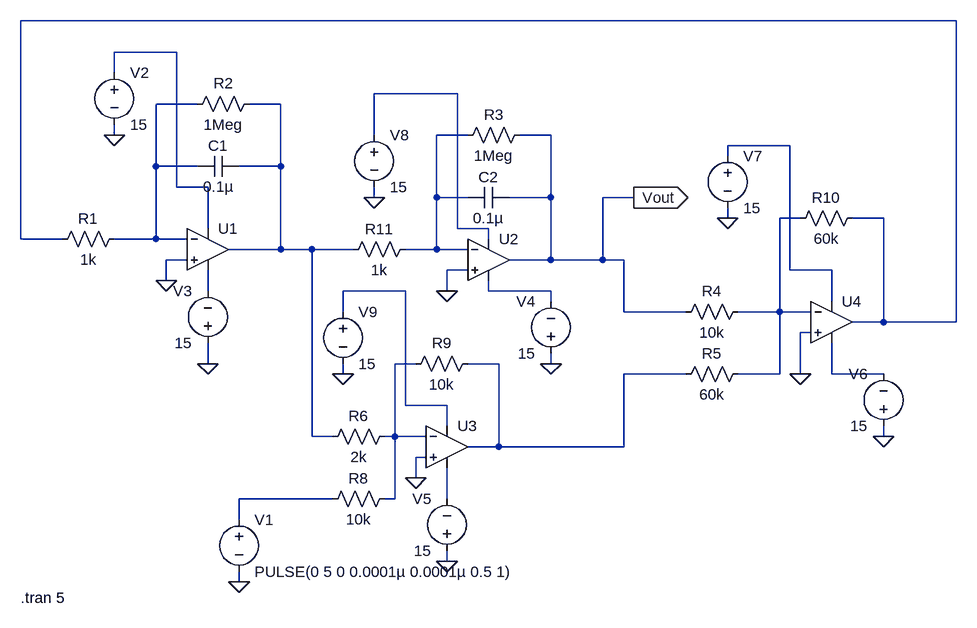
[diagram p0: schematic differential_equation_solver.asc]
differential_equation_solver.asc, the LTspice schematic file:
Version 4
SHEET 1 1252 680
WIRE 1248 -288 -192 -288
WIRE 48 -240 -48 -240
WIRE -48 -208 -48 -240
WIRE 480 -176 352 -176
WIRE 80 -160 16 -160
WIRE 208 -160 160 -160
WIRE -48 -112 -48 -128
WIRE 352 -112 352 -176
WIRE 496 -112 448 -112
WIRE 624 -112 576 -112
WIRE 992 -96 896 -96
WIRE 896 -80 896 -96
WIRE 16 -64 16 -160
WIRE 80 -64 16 -64
WIRE 208 -64 208 -160
WIRE 208 -64 144 -64
WIRE 48 -32 48 -240
WIRE 96 -32 48 -32
WIRE 352 -16 352 -32
WIRE 448 -16 448 -112
WIRE 496 -16 448 -16
WIRE 624 -16 624 -112
WIRE 624 -16 560 -16
WIRE 752 -16 704 -16
WIRE 896 16 896 0
WIRE 1008 16 976 16
WIRE 1136 16 1088 16
WIRE 96 32 96 -32
WIRE 480 32 480 -176
WIRE 528 32 480 32
WIRE -192 48 -192 -288
WIRE -128 48 -192 48
WIRE 16 48 16 -64
WIRE 16 48 -48 48
WIRE 64 48 16 48
WIRE 528 48 528 32
WIRE 208 64 208 -64
WIRE 208 64 128 64
WIRE 256 64 208 64
WIRE 320 64 256 64
WIRE 448 64 448 -16
WIRE 448 64 400 64
WIRE 496 64 448 64
WIRE 64 80 32 80
WIRE 624 80 624 -16
WIRE 624 80 560 80
WIRE 704 80 704 -16
WIRE 704 80 624 80
WIRE 736 80 704 80
WIRE 496 96 464 96
WIRE 992 96 992 -96
WIRE 1056 96 992 96
WIRE 32 112 32 80
WIRE 96 128 96 96
WIRE 400 128 304 128
WIRE 464 128 464 96
WIRE 528 128 528 112
WIRE 624 128 528 128
WIRE 624 144 624 128
WIRE 1056 144 1056 96
WIRE 304 160 304 128
WIRE 736 160 736 80
WIRE 832 160 736 160
WIRE 976 160 976 16
WIRE 976 160 912 160
WIRE 1024 160 976 160
WIRE 1136 176 1136 16
WIRE 1136 176 1088 176
WIRE 1248 176 1248 -288
WIRE 1248 176 1136 176
WIRE 1024 192 1008 192
WIRE 96 240 96 208
WIRE 416 240 384 240
WIRE 544 240 496 240
WIRE 624 240 624 224
WIRE 304 256 304 240
WIRE 832 256 736 256
WIRE 976 256 976 160
WIRE 976 256 912 256
WIRE 1008 256 1008 192
WIRE 1056 256 1056 208
WIRE 1136 256 1056 256
WIRE 400 304 400 128
WIRE 464 304 400 304
WIRE 464 336 464 304
WIRE 256 352 256 64
WIRE 288 352 256 352
WIRE 384 352 384 240
WIRE 384 352 368 352
WIRE 432 352 384 352
WIRE 1136 352 1136 336
WIRE 544 368 544 240
WIRE 544 368 496 368
WIRE 736 368 736 256
WIRE 736 368 544 368
WIRE 432 384 416 384
WIRE 416 416 416 384
WIRE 288 448 144 448
WIRE 384 448 384 352
WIRE 384 448 368 448
WIRE 464 448 464 400
WIRE 144 480 144 448
WIRE 464 544 464 528
WIRE 144 576 144 560
FLAG 1008 256 0
FLAG 464 128 0
FLAG 32 112 0
FLAG 144 576 0
FLAG 896 16 0
FLAG 352 -16 0
FLAG 304 256 0
FLAG -48 -112 0
FLAG 96 240 0
FLAG 624 240 0
FLAG 464 544 0
FLAG 1136 352 0
FLAG 416 416 0
FLAG 752 -16 Vout
IOPIN 752 -16 Out
SYMBOL OpAmps\\UniversalOpamp2 96 64 R0
SYMATTR InstName U1
SYMBOL OpAmps\\UniversalOpamp2 528 80 R0
SYMATTR InstName U2
SYMBOL OpAmps\\UniversalOpamp2 464 368 R0
SYMATTR InstName U3
SYMBOL OpAmps\\UniversalOpamp2 1056 176 R0
SYMATTR InstName U4
SYMBOL res -32 32 R90
WINDOW 0 0 56 VBottom 2
WINDOW 3 32 56 VTop 2
SYMATTR InstName R1
SYMATTR Value 1k
SYMBOL res 176 -176 R90
WINDOW 0 0 56 VBottom 2
WINDOW 3 32 56 VTop 2
SYMATTR InstName R2
SYMATTR Value 1Meg
SYMBOL res 592 -128 R90
WINDOW 0 0 56 VBottom 2
WINDOW 3 32 56 VTop 2
SYMATTR InstName R3
SYMATTR Value 1Meg
SYMBOL res 928 144 R90
WINDOW 0 0 56 VBottom 2
WINDOW 3 32 56 VTop 2
SYMATTR InstName R4
SYMATTR Value 10k
SYMBOL res 928 240 R90
WINDOW 0 0 56 VBottom 2
WINDOW 3 32 56 VTop 2
SYMATTR InstName R5
SYMATTR Value 60k
SYMBOL res 384 336 R90
WINDOW 0 0 56 VBottom 2
WINDOW 3 32 56 VTop 2
SYMATTR InstName R6
SYMATTR Value 2k
SYMBOL res 384 432 R90
WINDOW 0 0 56 VBottom 2
WINDOW 3 32 56 VTop 2
SYMATTR InstName R8
SYMATTR Value 10k
SYMBOL res 512 224 R90
WINDOW 0 0 56 VBottom 2
WINDOW 3 32 56 VTop 2
SYMATTR InstName R9
SYMATTR Value 10k
SYMBOL res 1104 0 R90
WINDOW 0 0 56 VBottom 2
WINDOW 3 32 56 VTop 2
SYMATTR InstName R10
SYMATTR Value 60k
SYMBOL cap 144 -80 R90
WINDOW 0 0 32 VBottom 2
WINDOW 3 32 32 VTop 2
SYMATTR InstName C1
SYMATTR Value 0.1µ
SYMBOL cap 560 -32 R90
WINDOW 0 0 32 VBottom 2
WINDOW 3 32 32 VTop 2
SYMATTR InstName C2
SYMATTR Value 0.1µ
SYMBOL res 416 48 R90
WINDOW 0 0 56 VBottom 2
WINDOW 3 32 56 VTop 2
SYMATTR InstName R11
SYMATTR Value 1k
SYMBOL voltage 144 464 R0
WINDOW 123 0 0 Left 0
WINDOW 39 0 0 Left 0
SYMATTR InstName V1
SYMATTR Value PULSE(0 5 0 0.0001µ 0.0001µ 0.5 1)
SYMBOL voltage -48 -224 R0
WINDOW 123 0 0 Left 0
WINDOW 39 0 0 Left 0
SYMATTR InstName V2
SYMATTR Value 15
SYMBOL voltage 96 224 R180
WINDOW 0 24 96 Left 2
WINDOW 3 24 16 Left 2
WINDOW 123 0 0 Left 0
WINDOW 39 0 0 Left 0
SYMATTR InstName V3
SYMATTR Value 15
SYMBOL voltage 624 240 R180
WINDOW 0 24 96 Left 2
WINDOW 3 24 16 Left 2
WINDOW 123 0 0 Left 0
WINDOW 39 0 0 Left 0
SYMATTR InstName V4
SYMATTR Value 15
SYMBOL voltage 464 544 R180
WINDOW 0 24 96 Left 2
WINDOW 3 24 16 Left 2
WINDOW 123 0 0 Left 0
WINDOW 39 0 0 Left 0
SYMATTR InstName V5
SYMATTR Value 15
SYMBOL voltage 1136 352 R180
WINDOW 0 24 96 Left 2
WINDOW 3 24 16 Left 2
WINDOW 123 0 0 Left 0
WINDOW 39 0 0 Left 0
SYMATTR InstName V6
SYMATTR Value 15
SYMBOL voltage 896 -96 R0
WINDOW 123 0 0 Left 0
WINDOW 39 0 0 Left 0
SYMATTR InstName V7
SYMATTR Value 15
SYMBOL voltage 352 -128 R0
WINDOW 123 0 0 Left 0
WINDOW 39 0 0 Left 0
SYMATTR InstName V8
SYMATTR Value 15
SYMBOL voltage 304 144 R0
WINDOW 123 0 0 Left 0
WINDOW 39 0 0 Left 0
SYMATTR InstName V9
SYMATTR Value 15
TEXT -192 600 Left 2 !.tran 5

The netlist it stands for:
* differential_equation_solver.asc
XU1 0 N004 N002 N009 N005 level.2 Avol=1Meg GBW=10Meg Slew=10Meg ilimit=25m rail=0 Vos=0 phimargin=45 en=0 enk=0 in=0 ink=0 Rin=500Meg  ; pins IN+ IN- V+ V- OUT
XU2 0 N006 N003 N011 Vout level.2 Avol=1Meg GBW=10Meg Slew=10Meg ilimit=25m rail=0 Vos=0 phimargin=45 en=0 enk=0 in=0 ink=0 Rin=500Meg  ; pins IN+ IN- V+ V- OUT
XU3 0 N012 N010 N016 N013 level.2 Avol=1Meg GBW=10Meg Slew=10Meg ilimit=25m rail=0 Vos=0 phimargin=45 en=0 enk=0 in=0 ink=0 Rin=500Meg  ; pins IN+ IN- V+ V- OUT
XU4 0 N008 N007 N014 N001 level.2 Avol=1Meg GBW=10Meg Slew=10Meg ilimit=25m rail=0 Vos=0 phimargin=45 en=0 enk=0 in=0 ink=0 Rin=500Meg  ; pins IN+ IN- V+ V- OUT
R1 N004 N001 1k
R2 N005 N004 1Meg
R3 Vout N006 1Meg
R4 N008 Vout 10k
R5 N008 N013 60k
R6 N012 N005 2k
R8 N012 N015 10k
R9 N013 N012 10k
R10 N001 N008 60k
C1 N005 N004 0.1µ
C2 Vout N006 0.1µ
R11 N006 N005 1k
V1 N015 0 PULSE(0 5 0 0.0001µ 0.0001µ 0.5 1)
V2 N002 0 15
V3 0 N009 15
V4 0 N011 15
V5 0 N016 15
V6 0 N014 15
V7 N007 0 15
V8 N003 0 15
V9 N010 0 15
.tran 5
.lib UniversalOpamps2.sub
.backanno
.end